# Altium schematic sheet Gyro.SchDoc
size Letter; Organization: Altium Limited; Address1: L3, 12a Rodborough Rd; Address2: Frenchs Forest; Address3: NSW; Address4: Australia 2086
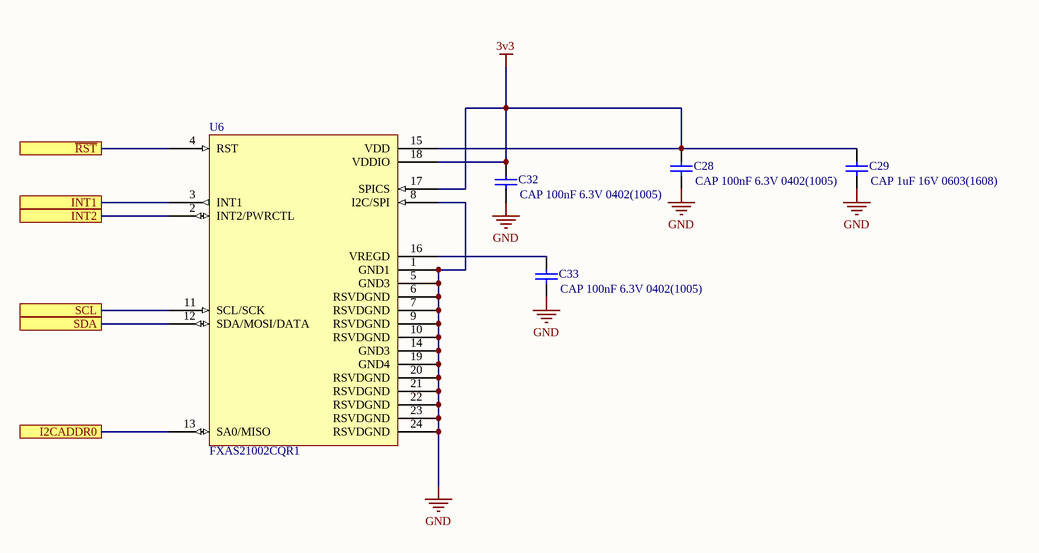
[diagram p0: Gyro.SchDoc]

## Parts
C28  CAP 100nF 6.3V 0402(1005)  [CAPC0402(1005)60_M]
C29  CAP 1uF 16V 0603(1608)  [CAPC0603(1608)100_L]
C32  CAP 100nF 6.3V 0402(1005)  [CAPC0402(1005)60_M]
C33  CAP 100nF 6.3V 0402(1005)  [CAPC0402(1005)60_M]
U6  FXAS21002CQR1  [QFN50P400X400X105-24N]

## Ports
I2CADDR0, INT1, INT2, SCL, SDA, ~{RST}

## Nets
3v3: C28.2 C29.2 C32.2 U6.15(VDD) U6.17(SPICS) U6.18(VDDIO)
GND: C28.1 C29.1 C32.1 C33.1 U6.1(GND1) U6.5(GND3) U6.6(RSVDGND) U6.7(RSVDGND) U6.8(I2C/SPI) U6.9(RSVDGND) U6.10(RSVDGND) U6.14(GND3) U6.19(GND4) U6.20(RSVDGND) U6.21(RSVDGND) U6.22(RSVDGND) U6.23(RSVDGND) U6.24(RSVDGND)
~{RST}: U6.4(RST) ; port ~{RST}
I2CADDR0: U6.13(SA0/MISO) ; port I2CADDR0
INT1: U6.3(INT1) ; port INT1
INT2: U6.2(INT2/PWRCTL) ; port INT2
SCL: U6.11(SCL/SCK) ; port SCL
SDA: U6.12(SDA/MOSI/DATA) ; port SDA
NetC33_2: C33.2 U6.16(VREGD)

## Notes on the sheet
- Title
- Size:
- Date:
- Letter
- Number:
- Time:
- Revision:
- Sheet
- of
- Copyright 2019
- Specialized Solutions LLC
- 206 W Lincoln Hwy STE B
- New Haven, IN 46774
- www.specsolns.com <http://www.specsolns.com>
- File:

## Library data of the parts
C28 C32 C33 = CMP-1034-02062-1: CAP 100nF 6.3V ±20% 0402 (1005 Metric) Thickness 0.6mm SMD; Case-EIA: 0402; Tolerance: Â±20%; Case-Metric: 1005; Value: 100nF; Technology: SMT; Max Thickness: 0.6 mm; Rated Voltage: 6.3 V
C29 = CMP-1035-02738-1: CAP 1uF 16V ±20% 0603 (1608 Metric) Thickness 1mm SMD; Case-Metric: 1608; Case-EIA: 0603; Tolerance: Â±20%; Value: 1uF; Rated Voltage: 16 V; Max Thickness: 1 mm; Technology: SMT
U6 = FXAS21002CQR1: 3-Axis Digital Angular Rate / Gyroscope